# Altium schematic sheet Sheet_1_2021-01-19.schdoc
size 49 x 37 mm
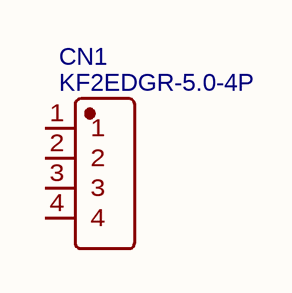
[diagram p0: Sheet_1_2021-01-19.schdoc]

## Parts
CN1  KF2EDGR-5.0-4P  [CONN-TH_4P-P5.00_KF2EDGR-5.0-4P]

## Nets

Not connected (* = marked no-connect by the designer): CN1 1 2 3 4

## Library data of the parts
CN1 = KF2EDGR-5.0-4P: BOM_Manufacturer: Cixi Kefa Elec; Contributor: LCSC; SMT Type: Extend; BOM_Supplier: LCSC; BOM_Supplier Part: C441195; BOM_Manufacturer Part: KF2EDGR-5.0-4P; BOM_JLCPCB SMD: Yes; spicePre: C; spiceSymbolName: KF2EDGR-5.0-4P